# EAGLE design pov-globe2 (EAGLE 6.6.0)
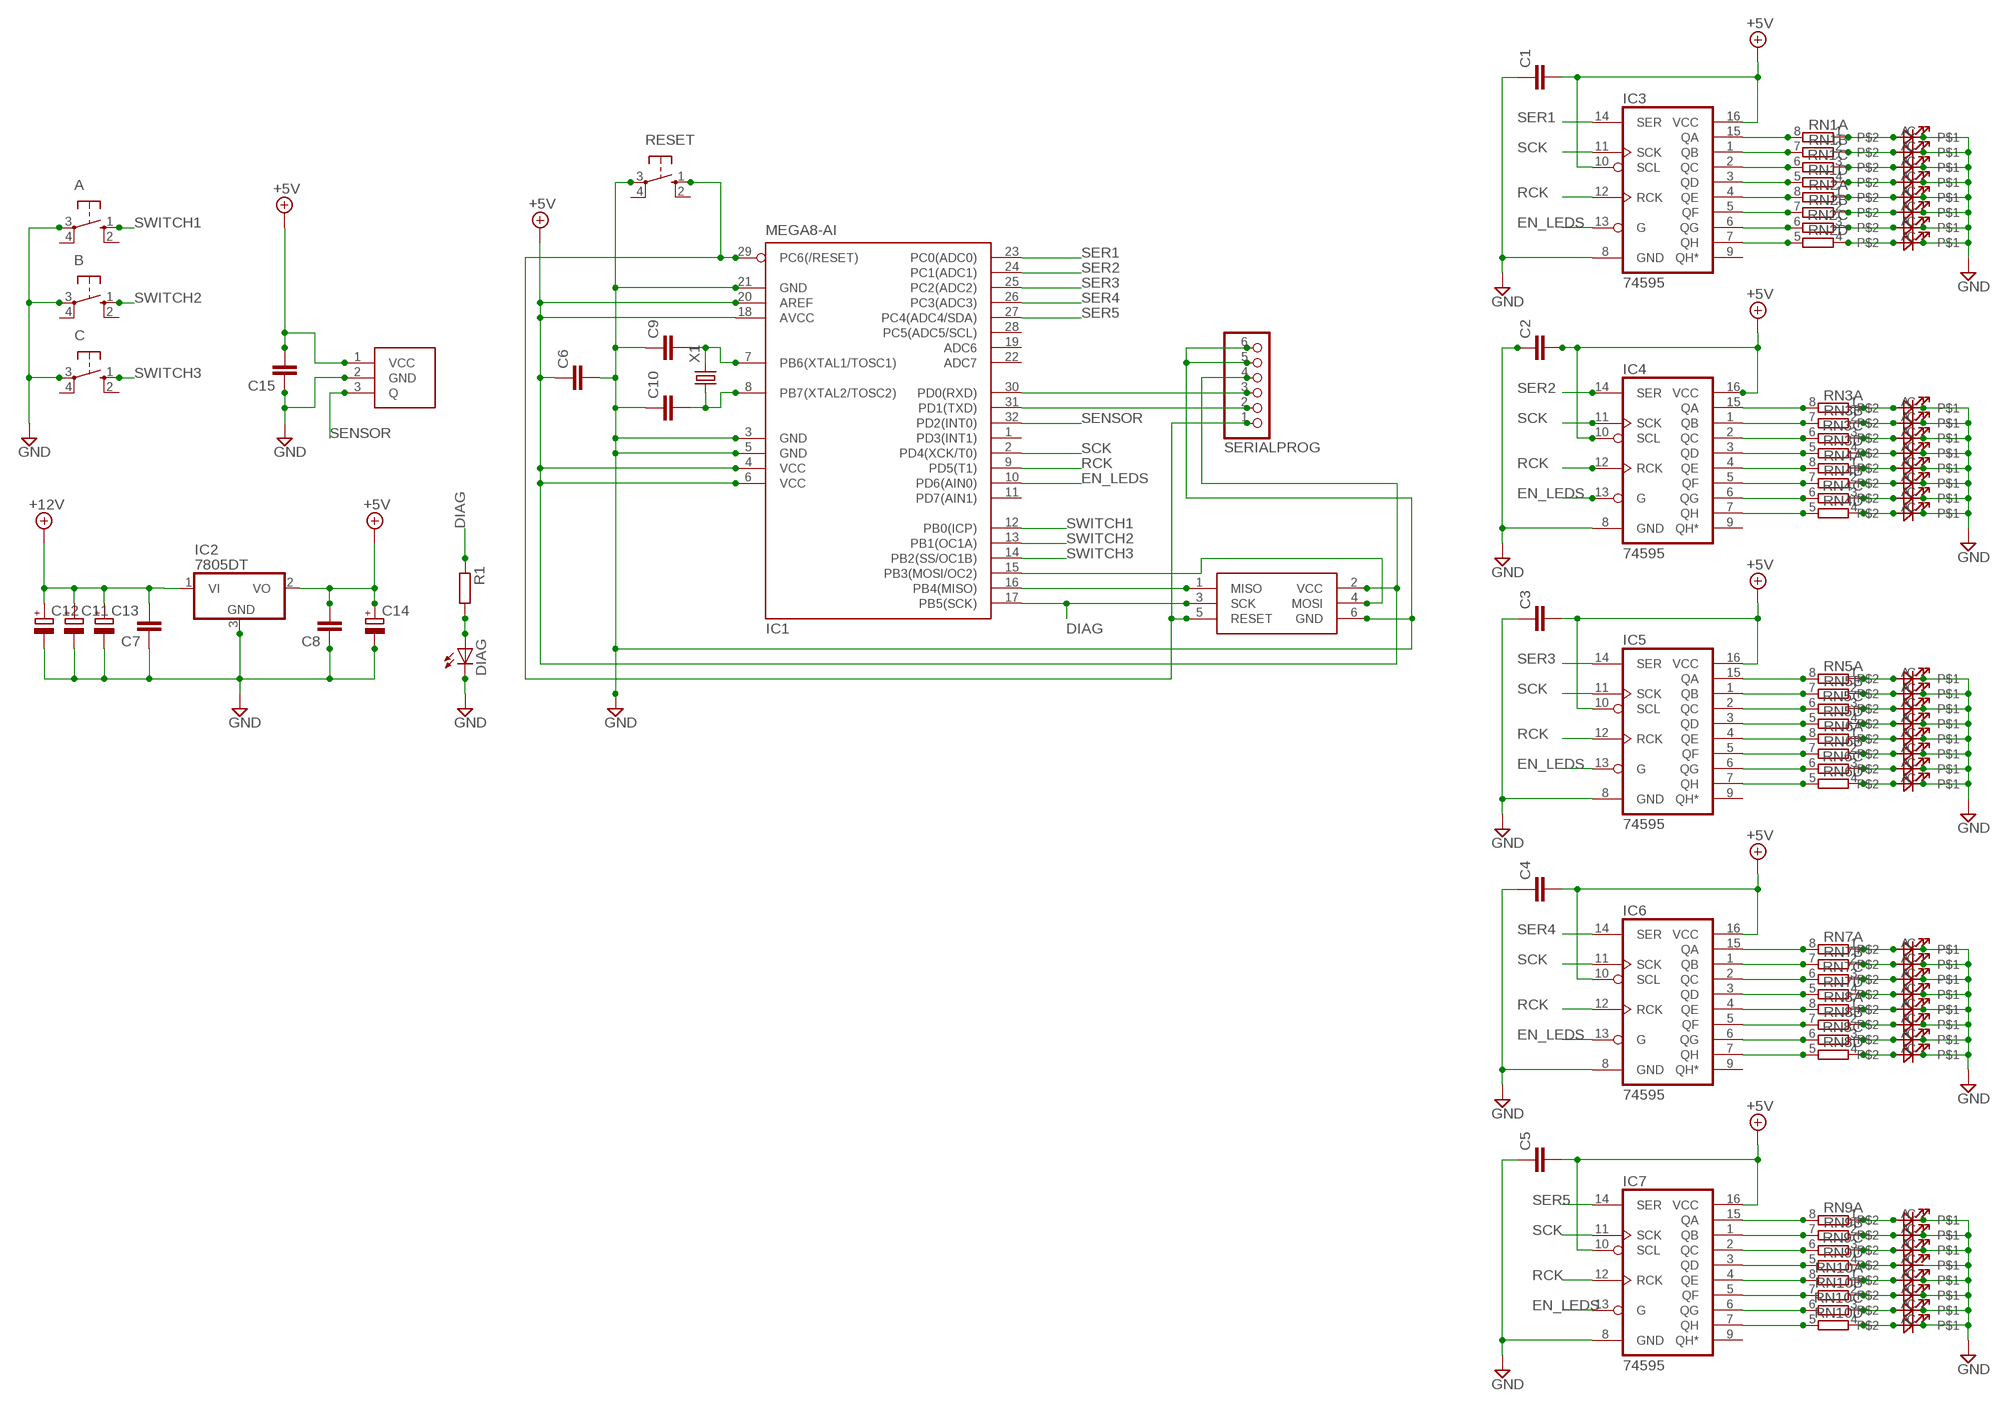
[diagram p0: schematic, sheet 1]

## Parts
0  3MMLEDSIDELED1_8MMSIDE  [LED1_8MMSIDE]
1  3MMLEDSIDELED1_8MMSIDE  [LED1_8MMSIDE]
2  3MMLEDSIDELED1_8MMSIDE  [LED1_8MMSIDE]
3  3MMLEDSIDELED1_8MMSIDE  [LED1_8MMSIDE]
4  3MMLEDSIDELED1_8MMSIDE  [LED1_8MMSIDE]
5  3MMLEDSIDELED1_8MMSIDE  [LED1_8MMSIDE]
6  3MMLEDSIDELED1_8MMSIDE  [LED1_8MMSIDE]
7  3MMLEDSIDELED1_8MMSIDE  [LED1_8MMSIDE]
8  3MMLEDSIDELED1_8MMSIDE  [LED1_8MMSIDE]
9  3MMLEDSIDELED1_8MMSIDE  [LED1_8MMSIDE]
10  3MMLEDSIDELED1_8MMSIDE  [LED1_8MMSIDE]
11  3MMLEDSIDELED1_8MMSIDE  [LED1_8MMSIDE]
12  3MMLEDSIDELED1_8MMSIDE  [LED1_8MMSIDE]
13  3MMLEDSIDELED1_8MMSIDE  [LED1_8MMSIDE]
14  3MMLEDSIDELED1_8MMSIDE  [LED1_8MMSIDE]
15  3MMLEDSIDELED1_8MMSIDE  [LED1_8MMSIDE]
16  3MMLEDSIDELED1_8MMSIDE  [LED1_8MMSIDE]
17  3MMLEDSIDELED1_8MMSIDE  [LED1_8MMSIDE]
18  3MMLEDSIDELED1_8MMSIDE  [LED1_8MMSIDE]
19  3MMLEDSIDELED1_8MMSIDE  [LED1_8MMSIDE]
20  3MMLEDSIDELED1_8MMSIDE  [LED1_8MMSIDE]
21  3MMLEDSIDELED1_8MMSIDE  [LED1_8MMSIDE]
22  3MMLEDSIDELED1_8MMSIDE  [LED1_8MMSIDE]
23  3MMLEDSIDELED1_8MMSIDE  [LED1_8MMSIDE]
24  3MMLEDSIDELED1_8MMSIDE  [LED1_8MMSIDE]
25  3MMLEDSIDELED1_8MMSIDE  [LED1_8MMSIDE]
26  3MMLEDSIDELED1_8MMSIDE  [LED1_8MMSIDE]
27  3MMLEDSIDELED1_8MMSIDE  [LED1_8MMSIDE]
28  3MMLEDSIDELED1_8MMSIDE  [LED1_8MMSIDE]
29  3MMLEDSIDELED1_8MMSIDE  [LED1_8MMSIDE]
30  3MMLEDSIDELED1_8MMSIDE  [LED1_8MMSIDE]
31  3MMLEDSIDELED1_8MMSIDE  [LED1_8MMSIDE]
32  3MMLEDSIDELED1_8MMSIDE  [LED1_8MMSIDE]
33  3MMLEDSIDELED1_8MMSIDE  [LED1_8MMSIDE]
34  3MMLEDSIDELED1_8MMSIDE  [LED1_8MMSIDE]
35  3MMLEDSIDELED1_8MMSIDE  [LED1_8MMSIDE]
36  3MMLEDSIDELED1_8MMSIDE  [LED1_8MMSIDE]
37  3MMLEDSIDELED1_8MMSIDE  [LED1_8MMSIDE]
38  3MMLEDSIDELED1_8MMSIDE  [LED1_8MMSIDE]
39  3MMLEDSIDELED1_8MMSIDE  [LED1_8MMSIDE]
A  10-XX  [B3F-10XX]
B  10-XX  [B3F-10XX]
C  10-XX  [B3F-10XX]
C1  C-EUC0805  [C0805]
C2  C-EUC0805  [C0805]
C3  C-EUC0805  [C0805]
C4  C-EUC0805  [C0805]
C5  C-EUC0805  [C0805]
C6  C-EUC0805  [C0805]
C7  C-EUC0805  [C0805]
C8  C-EUC0805  [C0805]
C9  C-EUC0805  [C0805]
C10  C-EUC0805  [C0805]
C11  CPOL-EUE2-5  [E2-5]
C12  CPOL-EUE2-5  [E2-5]
C13  CPOL-EUE2-5  [E2-5]
C14  CPOL-EUE2-5  [E2-5]
C15  C-EUC0805  [C0805]
DIAG  LEDCHIP-LED0805  [CHIP-LED0805]
IC1  MEGA8-AI  [TQFP32-08]
IC2  7805DT  [TO252]
IC3  74595  [TSSOP16]
IC4  74595  [TSSOP16]
IC5  74595  [TSSOP16]
IC6  74595  [TSSOP16]
IC7  74595  [TSSOP16]
ICSP  TAG_CONN_AVR  [TC2030-MCP-NL]
R1  R-EU_R0805  [R0805]
RESET  10-XX  [B3F-10XX]
RN1  4R-N0603-ARC  [0603-ARC]
RN2  4R-N0603-ARC  [0603-ARC]
RN3  4R-N0603-ARC  [0603-ARC]
RN4  4R-N0603-ARC  [0603-ARC]
RN5  4R-N0603-ARC  [0603-ARC]
RN6  4R-N0603-ARC  [0603-ARC]
RN7  4R-N0603-ARC  [0603-ARC]
RN8  4R-N0603-ARC  [0603-ARC]
RN9  4R-N0603-ARC  [0603-ARC]
RN10  4R-N0603-ARC  [0603-ARC]
S1  3144HALLSWITCH  [3144HALLSWITCH]
SERIALPROG  PINHD-1X6  [1X06]
X1  CRYSTALHC49U-V  [HC49U-V]

## Nets
+5V: C1.2 C2.2 C3.2 C4.2 C5.2 C6.1 C8.2 C14.+ C15.2 IC1.4(VCC) IC1.6(VCC) IC1.18(AVCC) IC1.20(AREF) IC2.2(VO) IC3.10(SCL) IC3.16(VCC) IC4.10(SCL) IC4.16(VCC) IC5.10(SCL) IC5.16(VCC) IC6.10(SCL) IC6.16(VCC) IC7.10(SCL) IC7.16(VCC) ICSP.2(VCC) S1.1(VCC) SERIALPROG.4
+12V: C7.2 C11.+ C12.+ C13.+ IC2.1(VI)
DIAG: IC1.17(PB5(SCK)) ICSP.3(SCK) R1.1
EN_LEDS: IC1.10(PD6(AIN0)) IC3.13(G) IC4.13(G) IC5.13(G) IC6.13(G) IC7.13(G)
GND: 0.C 1.C 2.C 3.C 4.C 5.C 6.C 7.C 8.C 9.C 10.C 11.C 12.C 13.C 14.C 15.C 16.C 17.C 18.C 19.C 20.C 21.C 22.C 23.C 24.C 25.C 26.C 27.C 28.C 29.C 30.C 31.C 32.C 33.C 34.C 35.C 36.C 37.C 38.C 39.C A.3(P) B.3(P) C1.1 C2.1 C3.1 C4.1 C5.1 C6.2 C7.1 C8.1 C9.1 C10.1 C11.- C12.- C13.- C14.- C15.1 C.3(P) DIAG.C IC1.3(GND) IC1.5(GND) IC1.21(GND) IC2.3(GND) IC3.8(GND) IC4.8(GND) IC5.8(GND) IC6.8(GND) IC7.8(GND) ICSP.6(GND) RESET.3(P) S1.2(GND) SERIALPROG.5 SERIALPROG.6
N$1: IC3.15(QA) RN1.8
N$2: IC3.1(QB) RN1.7
N$3: IC3.2(QC) RN1.6
N$4: IC3.3(QD) RN1.5
N$5: IC3.4(QE) RN2.8
N$6: IC3.5(QF) RN2.7
N$7: IC3.6(QG) RN2.6
N$8: IC3.7(QH) RN2.5
N$9: 0.A RN1.1
N$10: 1.A RN1.2
N$11: 2.A RN1.3
N$12: 3.A RN1.4
N$13: 4.A RN2.1
N$14: 5.A RN2.2
N$15: 6.A RN2.3
N$16: 7.A RN2.4
N$17: IC1.31(PD1(TXD)) SERIALPROG.2
N$18: IC1.30(PD0(RXD)) SERIALPROG.3
N$19: IC1.16(PB4(MISO)) ICSP.1(MISO)
N$20: IC6.15(QA) RN7.8
N$21: IC1.15(PB3(MOSI/OC2)) ICSP.4(MOSI)
N$22: IC6.1(QB) RN7.7
N$23: IC4.15(QA) RN3.8
N$24: IC4.1(QB) RN3.7
N$25: IC4.2(QC) RN3.6
N$26: IC4.3(QD) RN3.5
N$27: IC4.4(QE) RN4.8
N$28: IC4.5(QF) RN4.7
N$29: IC4.6(QG) RN4.6
N$30: IC4.7(QH) RN4.5
N$31: 8.A RN3.1
N$32: 9.A RN3.2
N$33: 10.A RN3.3
N$34: 11.A RN3.4
N$35: 12.A RN4.1
N$36: 13.A RN4.2
N$37: 14.A RN4.3
N$38: IC1.29(PC6(/RESET)) ICSP.5(RESET) RESET.1(S) SERIALPROG.1
N$39: DIAG.A R1.2
N$40: 15.A RN4.4
N$41: IC5.15(QA) RN5.8
N$42: IC5.1(QB) RN5.7
N$43: IC5.2(QC) RN5.6
N$44: IC5.3(QD) RN5.5
N$45: IC5.4(QE) RN6.8
N$46: IC5.5(QF) RN6.7
N$47: IC5.6(QG) RN6.6
N$48: IC5.7(QH) RN6.5
N$49: 16.A RN5.1
N$50: 17.A RN5.2
N$51: 18.A RN5.3
N$52: 19.A RN5.4
N$53: 20.A RN6.1
N$54: 21.A RN6.2
N$55: 22.A RN6.3
N$56: 23.A RN6.4
N$57: IC6.2(QC) RN7.6
N$58: IC6.3(QD) RN7.5
N$59: C9.2 IC1.7(PB6(XTAL1/TOSC1)) X1.2
N$60: C10.2 IC1.8(PB7(XTAL2/TOSC2)) X1.1
N$61: IC6.4(QE) RN8.8
N$62: IC6.5(QF) RN8.7
N$63: IC6.6(QG) RN8.6
N$64: IC6.7(QH) RN8.5
N$65: IC7.15(QA) RN9.8
N$66: 24.A RN7.1
N$67: 25.A RN7.2
N$68: 26.A RN7.3
N$69: 27.A RN7.4
N$70: 28.A RN8.1
N$71: 29.A RN8.2
N$72: 30.A RN8.3
N$73: 31.A RN8.4
N$74: IC7.1(QB) RN9.7
N$75: IC7.2(QC) RN9.6
N$76: IC7.3(QD) RN9.5
N$77: IC7.4(QE) RN10.8
N$78: IC7.5(QF) RN10.7
N$79: IC7.6(QG) RN10.6
N$80: IC7.7(QH) RN10.5
N$81: 32.A RN9.1
N$82: 33.A RN9.2
N$83: 34.A RN9.3
N$84: 35.A RN9.4
N$85: 36.A RN10.1
N$86: 37.A RN10.2
N$87: 38.A RN10.3
N$88: 39.A RN10.4
RCK: IC1.9(PD5(T1)) IC3.12(RCK) IC4.12(RCK) IC5.12(RCK) IC6.12(RCK) IC7.12(RCK)
SCK: IC1.2(PD4(XCK/T0)) IC3.11(SCK) IC4.11(SCK) IC5.11(SCK) IC6.11(SCK) IC7.11(SCK)
SENSOR: IC1.32(PD2(INT0)) S1.3(Q)
SER1: IC1.23(PC0(ADC0)) IC3.14(SER)
SER2: IC1.24(PC1(ADC1)) IC4.14(SER)
SER3: IC1.25(PC2(ADC2)) IC5.14(SER)
SER4: IC1.26(PC3(ADC3)) IC6.14(SER)
SER5: IC1.27(PC4(ADC4/SDA)) IC7.14(SER)
SWITCH1: A.1(S) IC1.12(PB0(ICP))
SWITCH2: B.1(S) IC1.13(PB1(OC1A))
SWITCH3: C.1(S) IC1.14(PB2(SS/OC1B))
Unconnected: A.2(S1) A.4(P1) B.2(S1) B.4(P1) C.2(S1) C.4(P1) IC1.1(PD3(INT1)) IC1.11(PD7(AIN1)) IC1.19(ADC6) IC1.22(ADC7) IC1.28(PC5(ADC5/SCL)) IC3.9(QH*) IC4.9(QH*) IC5.9(QH*) IC6.9(QH*) IC7.9(QH*) RESET.2(S1) RESET.4(P1)

## Library data of the parts
0 1-39 = jason_eagle6:3MMLEDSIDE
A B C RESET = switch-omron:10-XX: OMRON SWITCH
C1-C10 C15 = rcl:C-EU: CAPACITOR, European symbol
C11-C14 = rcl:CPOL-EU: POLARIZED CAPACITOR, European symbol
DIAG = led:LED: LED OSRAM: - CHIPLED LG R971, LG N971, LY N971, LG Q971, LY Q971, LO R971, LY R971 LH N974, LH R974 LS Q976, LO Q976, LY Q976 LO Q996 - Hyper CHIPLED LW Q18S LB Q993, LB Q99A, LB R99A - SideLED LS A670, LO A670, LY A670, LG A670, LP A670 LB A673, LV A673, LT A673, LW A673 LH A674 LY A675 LS A676, LA A676, LO A676, LY A676, LW A676 LS A679, LY A679, LG A679 - Hyper Micro SIDELED® LS Y876, LA Y876, LO Y876, LY Y876 LT Y87S - SmartLED LW L88C, LW L88S LB L89C, LB L89S, LG L890 LS L89K, LO L89K, LY L89K LS L896, LA L896, LO L896, LY L896 - TOPLED LS T670, LO T670, LY T670, LG T670, LP T670 LSG T670, LSP T670, LSY T670, LOP T670, LYG T670 LG T671, LOG T671, LSG T671 LB T673, LV T673, LT T673, LW T673 LH T674 LS T676, LA T676, LO T676, LY T676, LB T676, LH T676, LSB T676, LW T676 LB T67C, LV T67C, LT T67C, LS T67K, LO T67K, LY T67K, LW E67C LS E67B, LA E67B, LO E67B, LY E67B, LB E67C, LV E67C, LT E67C LW T67C LS T679, LY T679, LG T679 LS T770, LO T770, LY T770, LG T770, LP T770 LB T773, LV T773, LT T773, LW T773 LH T774 LS E675, LA E675, LY E675, LS T675 LS T776, LA T776, LO T776, LY T776, LB T776 LHGB T686 LT T68C, LB T68C - Hyper Mini TOPLED® LB M676 - Mini TOPLED Santana® LG M470 LS M47K, LO M47K, LY M47K Source: http://www.osram.convergy.de LUXEON: - LUMILED® LXK2-PW12-R00, LXK2-PW12-S00, LXK2-PW14-U00, LXK2-PW14-V00 LXK2-PM12-R00, LXK2-PM12-S00, LXK2-PM14-U00 LXK2-PE12-Q00, LXK2-PE12-R00, LXK2-PE12-S00, LXK2-PE14-T00, LXK2-PE14-U00 LXK2-PB12-K00, LXK2-PB12-L00, LXK2-PB12-M00, LXK2-PB14-N00, LXK2-PB14-P00, LXK2-PB14-Q00 LXK2-PR12-L00, LXK2-PR12-M00, LXK2-PR14-Q00, LXK2-PR14-R00 LXK2-PD12-Q00, LXK2-PD12-R00, LXK2-PD12-S00 LXK2-PH12-R00, LXK2-PH12-S00 LXK2-PL12-P00, LXK2-PL12-Q00, LXK2-PL12-R00 Source: www.luxeon.com KINGBRIGHT: KA-3528ASYC Source: www.kingbright.com
IC1 = atmel:MEGA8: MICROCONTROLLER 8 Kbytes FLASH, 1 kbytes SRAM, 512 bytes EEPROM, USART, 6-channel 10 bit ADC, 2-channel 8 bit ADC Pin compatible with Atmega48, ATMega88, ATMega168 Source: avr.lbr
IC2 = linear:78*: Positive VOLTAGE REGULATOR Source: http://cache.national.com/ds/LM/LM78L05.pdf http://www.fairchildsemi.com/ds/LM/LM7805.pdf
IC3-IC7 = SparkFun:74*595: 8-bit SHIFT REGISTER, output latch
ICSP = jasons_stuff:TAG_CONN_AVR
R1 = resistor:R-EU_: RESISTOR, European symbol
RN1-RN10 = resistor-dil:4R-N: Array Chip Resistor Source: RS Component / Phycomp; OC_FARNELL: unknown; OC_NEWARK: unknown
S1 = jason_eagle6:3144HALLSWITCH
SERIALPROG = pinhead:PINHD-1X6: PIN HEADER
X1 = crystal:CRYSTAL: CRYSTAL

## Board
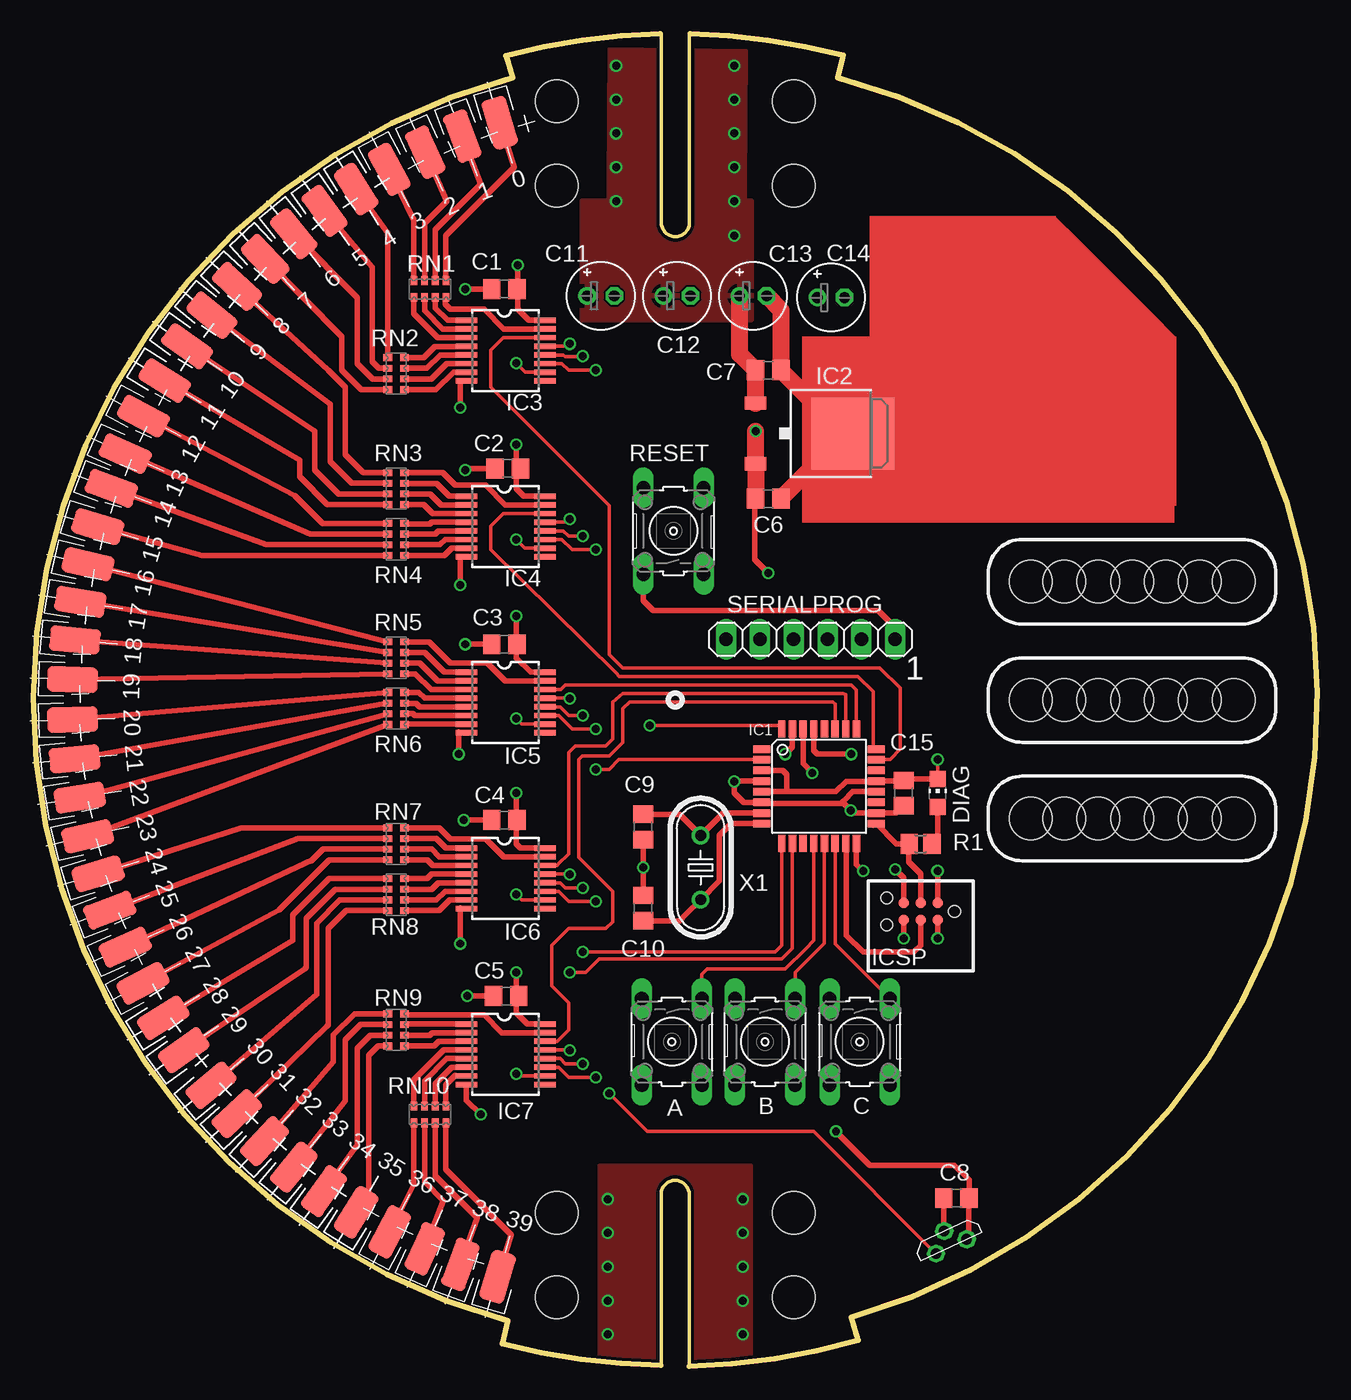
[diagram p1: board, top side]
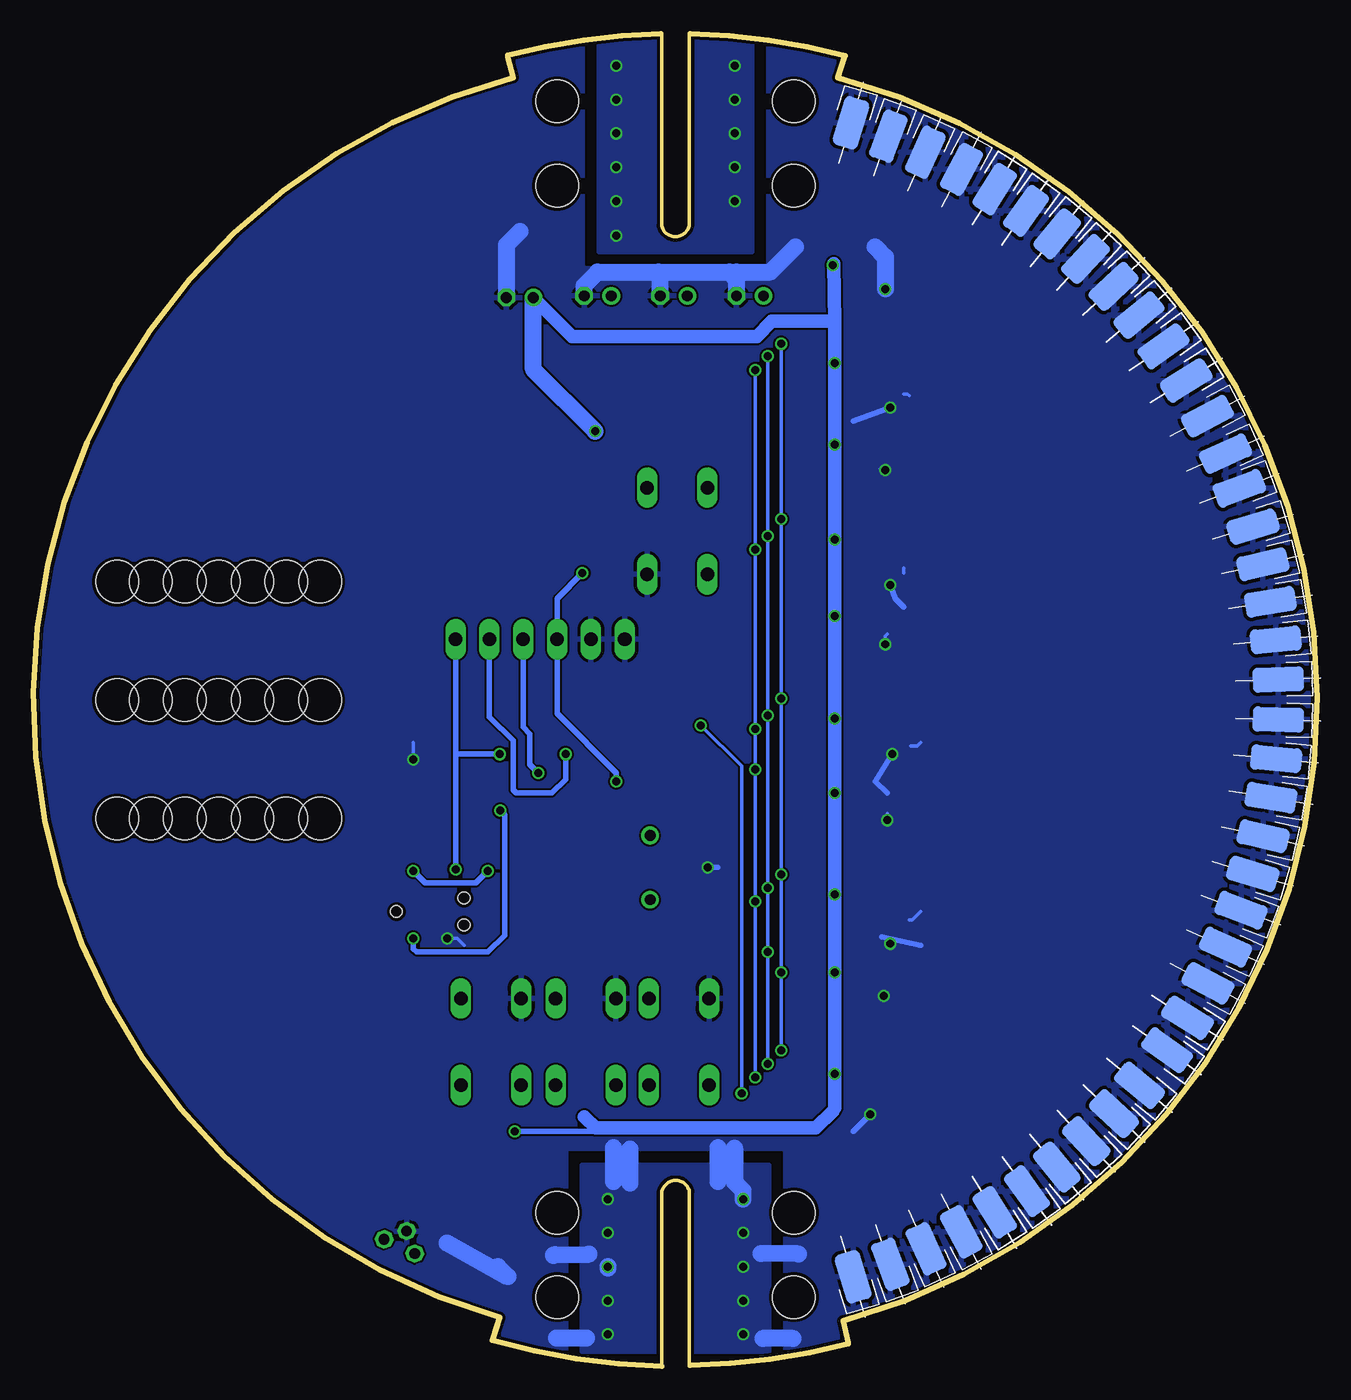
[diagram p2: board, bottom side, seen from below]

Size 96.38 x 100.08 mm. Coordinates in mm from the lower left corner, seen from the top.
Outline: 35.48,98.4 35.99,96.75 arc150 35.61,3.4 35.23,1.75
Outline: 61.9,2.01 61.39,3.66 arc149 60.37,96.75 60.75,98.27
Outline: 47.14,100.08 47.14,85.67
Outline: 49.22,100.03 49.22,85.65
Outline: 49.22,13.08 49.22,0 arc15 61.92,1.93
Outline: 47.14,0 47.14,13.11
Outline: 49.2,13.13 arc154 47.14,13.13
Outline: 47.16,85.62 arc154 49.22,85.62
Outline: 35.46,98.4 arc-13 47.06,100.05
Outline: 49.3,100.05 arc-13 60.78,98.42
Outline: 35.2,1.7 arc14 47.09,0.08
Copper layers (1*16): Top 0.035mm / dielectric 1.5mm / Bottom 0.035mm
Design rules "ITEADstudio_DRC": minimum track width 6mil, minimum drill 12mil, track to track 6mil, track to pad 6mil, pad to pad 6mil, via to via 6mil, smd to smd 0mil, copper to edge 10mil, drill to drill 10mil, minimum pad ring 10mil, minimum via ring 6mil, stop-mask expansion 2mil, vias tented up to drill 100mil, thermal gap 10mil
Holes 3.2 mm at 79.93,58.9 90.09,58.9 82.47,58.9 74.85,58.9 77.39,58.9 85.01,58.9 87.55,58.9 79.93,50.01 90.09,50.01 82.47,50.01 74.85,50.01 77.39,50.01 85.01,50.01 87.55,50.01 79.93,41.12 90.09,41.12 82.47,41.12 74.85,41.12 77.39,41.12 85.01,41.12 87.55,41.12 39.29,88.62 57.07,88.62 39.29,11.53 57.07,11.53 39.29,94.97 57.07,94.97 39.29,5.18 57.07,5.18

### Footprints (pad centres in the part's own frame; a part is rotated, then mirrored left to right if it is on the bottom)
LED1_8MMSIDE = smd 3.81 x 1.905: A -3.175,0 | smd 3.81 x 1.905 bottom: C -3.175,0
B3F-10XX = drill 1.016 long: 1 -3.251,2.261; 2 3.251,2.261; 3 -3.251,-2.261; 4 3.251,-2.261
C0805 = smd 1.3 x 1.5: 1 -0.95,0; 2 0.95,0
E2-5 = drill 0.813 pad 1.27: + -1.016,0 | drill 0.813 pad 1.27 octagon: - 1.016,0
CHIP-LED0805 = smd 1.2 x 1.2: A 0,-1.05; C 0,1.05
TQFP32-08 = smd 1.27 x 0.559: 1 -4.293,2.8; 2 -4.293,2; 3 -4.293,1.2; 4 -4.293,0.4; 5 -4.293,-0.4; 6 -4.293,-1.2; 7 -4.293,-2; 8 -4.293,-2.8; 17 4.293,-2.8; 18 4.293,-2; 19 4.293,-1.2; 20 4.293,-0.4; 21 4.293,0.4; 22 4.293,1.2; 23 4.293,2; 24 4.293,2.8 | smd 0.559 x 1.27: 9 -2.8,-4.293; 10 -2,-4.293; 11 -1.2,-4.293; 12 -0.4,-4.293; 13 0.4,-4.293; 14 1.2,-4.293; 15 2,-4.293; 16 2.8,-4.293; 25 2.8,4.293; 26 2,4.293; 27 1.2,4.293; 28 0.4,4.293; 29 -0.4,4.293; 30 -1.2,4.293; 31 -2,4.293; 32 -2.8,4.293
TO252 = smd 1 x 1.6: 1 -2.28,-4.8; 2 2.28,-4.8 | smd 5.4 x 6.2: 3 0,2.5
TSSOP16 = smd 0.4 x 1.6: 1 -2.225,-2.85; 2 -1.575,-2.85; 3 -0.925,-2.85; 4 -0.275,-2.85; 5 0.375,-2.85; 6 1.025,-2.85; 7 1.675,-2.85; 8 2.325,-2.85; 9 2.325,3.05; 10 1.675,3.05; 11 1.025,3.05; 12 0.375,3.05; 13 -0.275,3.05; 14 -0.925,3.05; 15 -1.575,3.05; 16 -2.225,3.05
TC2030-MCP-NL = smd 0.787 x 0.787: 1 1.27,-0.635; 2 1.27,0.635; 3 2.54,-0.635; 4 2.54,0.635; 5 3.81,-0.635; 6 3.81,0.635 | hole 0.889: 0,0; 5.08,-1.016; 5.08,1.016
R0805 = smd 1.3 x 1.5: 1 -0.85,0; 2 0.85,0
0603-ARC = smd 0.5 x 0.65: 1 -1.2,-0.625; 2 -0.4,-0.625; 3 0.4,-0.625; 4 1.2,-0.625; 5 1.2,0.625; 6 0.4,0.625; 7 -0.4,0.625; 8 -1.2,0.625
3144HALLSWITCH = drill 0.8 octagon: 1 -1.905,-1.27; 2 -0.635,0; 3 -1.905,1.27
1X06 = drill 1.016 long: 1 -6.35,0; 2 -3.81,0; 3 -1.27,0; 4 1.27,0; 5 3.81,0; 6 6.35,0
HC49U-V = drill 0.813: 1 -2.413,0; 2 2.413,0

### Placement (x,y rotation side)
0  34.08,96.39 106.9 top
1  31.09,95.33 110.6 top
2  28.11,94.03 114.4 top
3  25.22,92.66 118.1 top
4  22.55,91.08 121.9 top
5  20.01,89.33 125.6 top
6  17.52,87.48 129.4 top
7  15.24,85.45 133.1 top
8  12.98,83.24 136.9 top
9  10.94,80.92 140.6 top
10  8.96,78.44 144.4 top
11  7.16,75.69 148.1 top
12  5.46,72.82 151.9 top
13  4.01,69.82 155.6 top
14  2.89,67.03 159.4 top
15  1.8,63.96 163.1 top
16  1.01,60.93 166.9 top
17  0.4,57.91 170.6 top
18  -0.03,54.84 174.4 top
19  -0.23,51.66 178.1 top
20  -0.23,48.44 181.9 top
21  -0.05,45.29 185.6 top
22  0.35,42.16 189.4 top
23  0.99,39.07 193.1 top
24  1.83,36.04 196.9 top
25  2.76,33.12 200.6 top
26  4.01,30.15 204.4 top
27  5.43,27.25 208.1 top
28  7.06,24.49 211.9 top
29  8.71,21.87 215.6 top
30  10.89,19.08 219.4 top
31  12.95,16.79 223.1 top
32  15.19,14.58 226.9 top
33  17.55,12.5 230.6 top
34  19.96,10.57 234.4 top
35  22.55,8.86 238.1 top
36  25.24,7.29 241.9 top
37  28.06,5.92 245.6 top
38  30.93,4.67 249.4 top
39  33.93,3.68 253.1 top
A  47.93,24.36 270 top
B  54.91,24.36 270 top
C  62.02,24.36 270 top
C1  35.35,80.87 0 top
C2  35.61,67.41 0 top
C3  35.35,54.2 0 top
C4  35.35,41 0 top
C5  35.48,27.79 0 top
C6  55.17,65.13 0 top
C7  55.17,74.78 180 top
C8  69.29,12.62 0 top
C9  45.77,40.49 90 top
C10  45.77,34.39 270 top
C11  42.59,80.37 0 top
C12  48.31,80.37 0 top
C13  54.02,80.37 0 top
C14  59.86,80.24 0 top
C15  65.33,43.03 270 top
DIAG  67.87,43.03 0 top
IC1  58.98,43.54 0 top
IC2  59,70.03 270 top
IC3  35.35,76.3 270 top
IC4  35.35,63.09 270 top
IC5  35.35,49.89 270 top
IC6  35.35,36.68 270 top
IC7  35.35,23.47 270 top
ICSP  69.14,34.14 180 top
R1  66.6,39.22 0 top
RESET  48.05,62.71 90 top
RN1  29.77,80.87 180 top
RN2  27.23,74.52 270 top
RN3  27.23,65.89 270 top
RN4  27.23,62.08 270 top
RN5  27.23,53.19 270 top
RN6  27.23,49.38 270 top
RN7  27.23,39.22 270 top
RN8  27.23,35.41 270 top
RN9  27.23,25.25 270 top
RN10  29.77,18.9 0 top
S1  68.09,10.72 115 top
SERIALPROG  58.34,54.58 180 top
X1  50.09,37.44 90 top

### Tracks (layer width: path | path; a pad name or v marks a point on that pad's centre or on a via)
+5V  (via drill 0.6)
  Top 0.254: 36.37,27.73 C5.2 | 36.24,40.93 C4.2 | 36.5,67.35 C2.2 | IC7.10 36.39,21.79 v36.24,21.95 | IC6.10 36.65,35 v36.24,35.41 | IC5.10 36.67,48.21 v36.24,48.64 | IC4.10 36.9,61.42 v36.24,62.08 | IC3.10 36.93,74.63 v36.24,75.31 | 54.61,42.27 IC1.6 54.75,42.27
  Top 0.406: C15.2 64.78,41.54 IC1.18 61.52,41.54 v61.34,41.71 60.82,42.23 60.82,42.46 | IC1.20 61.5,43.14 60.82,42.46 | 54.75,42.27 60.63,42.27 60.82,42.46 | IC1.6 53.32,42.34 52.63,43.03 v52.63,43.92 52.64,43.94 IC1.4 54.66,43.92 | v60.25,17.63 62.79,15.09 69.14,15.09 70.24,13.99 C8.2 70.2,12.59 70.2,9.68 S1.1 | IC2.2 54.22,67.76 | C6.1 54.15,65.06 54.15,60.55 v55.17,59.54 | ICSP.2 v67.87,32.11 | v36.24,29.57 36.24,27.98 C5.2 36.12,27.79 36.24,27.66 36.24,26.52 37.07,25.69 IC7.16 | IC6.16 36.56,38.9 36.24,39.22 36.24,40.93 | v36.24,43.03 36.24,41.06 C4.2 | IC5.16 37.32,52.11 36.24,53.19 36.24,54.14 C3.2 36.24,54.26 v36.24,56.34 | IC4.16 36.81,65.32 36.24,65.89 36.24,67.1 C2.2 36.24,67.73 v36.24,69.19 | 36.25,80.82 C1.2 | IC3.16 37.19,78.53 36.37,79.35 36.37,80.81 C1.2 | v36.37,82.65 36.37,80.94 C1.2
  Top 1.27: IC2.2 54.22,67.73 C6.1 | 54.22,67.76 v54.22,70.21
  Bottom 0.406: 55.04,18.72 53.95,17.63 | 53.95,17.63 53.9,17.63 | 53.95,17.63 v60.25,17.63 | SERIALPROG.4 57.07,56.74 | v55.17,59.54 57.07,57.63 SERIALPROG.4 | v67.87,32.11 67.87,31.34 67.61,31.09 62.28,31.09 61.01,32.36 61.01,41.38 v61.34,41.71 | SERIALPROG.4 57.07,49 52.63,44.55 v52.63,43.92 | 36.37,78.46 v36.37,82.65
  Bottom 1.016: 36.29,82.78 36.24,78.33 | 36.24,78.33 v36.24,75.31 v36.24,69.19 v36.24,62.08 v36.24,56.34 v36.24,48.64 v36.24,43.03 v36.24,35.41 v36.24,29.57 v36.24,21.95 36.24,19.41 36.37,19.15 37.64,17.88 54.15,17.88 55.04,18.72 | C14.+ 55.93,77.32 42.08,77.32 40.94,78.46 36.37,78.46 36.24,78.33
  Bottom 1.27: v54.22,70.21 58.85,74.84 C14.+
+12V  (via drill 0.6)
  Top 1.27: IC2.1 54.2,74.76 C7.2 53.01,75.99 C13.+
  other vias: 43.74,97.64 43.74,95.1 43.74,92.56 43.74,90.02 43.74,87.48 52.63,97.64 52.63,95.1 52.63,92.56 52.63,90.02 52.63,87.48 52.63,84.89
  pour Top: 43.23,98.91 43.1,83.54 53.39,83.41 53.51,98.78
  pour Bottom: 42.47,83.67 42.47,101.45 53.9,101.45 53.9,83.67
  pour Top: 47.55,78.59 53.9,78.59 53.9,87.48 41.2,87.48 41.2,78.59
DIAG
  Top 0.254: 63.04,40.51 IC1.17
  Top 0.406: IC1.17 64.79,39.22 R1.1 65.71,39.18 65.71,37.85 66.6,36.96 ICSP.3
EN_LEDS  (via drill 0.6)
  Top 0.254: IC5.13 39.98,50.16 v40.26,50.14 | IC6.13 40.23,36.95 v40.26,36.93 | IC7.13 40.02,23.74 v40.26,23.72 | IC4.13 40.02,63.37 v40.26,63.6 | IC3.13 40.07,76.58 v40.26,76.76 | IC1.10 56.98,31.38 56.18,30.58 42.47,30.58 41.45,29.57 v40.26,29.57
  Bottom 0.254: v40.26,76.76 40.26,64.62 | 40.26,64.62 v40.26,63.6 | v40.26,63.6 40.26,50.65 | 40.26,50.65 v40.26,50.14 | v40.26,50.14 40.26,37.95 | 40.26,37.95 v40.26,36.93 | v40.26,36.93 v40.26,29.57 | v40.26,29.57 40.26,27.79 | 40.26,27.79 40.26,25.25 | 40.26,25.25 v40.26,23.72 40.26,25.25 | v40.26,50.14 40.26,50.65 | v40.26,63.6 40.26,64.62 | v40.26,36.93 40.26,37.95 | v40.26,29.57 40.26,27.79
GND  (via drill 0.6)
  Top 0.254: IC3.8 32.01,73.98 | 63.16,44.04 IC1.21 | DIAG.C v67.87,45.57 | S1.2 68.34,10.17
  Top 0.406: IC1.21 63.8,43.94 | 63.8,43.94 65.28,43.94 C15.1 65.43,44.08 DIAG.C | C10.1 v45.77,37.44 C9.1 | IC1.5 56.56,43.14 | 56.56,43.14 60.23,43.14 61.01,43.92 63.78,43.92 63.8,43.94 | IC1.3 56.25,44.74 56.56,44.42 56.56,43.14 | 68.34,10.17 C8.1 | ICSP.6 v65.33,32.11 | IC7.8 32.5,19.97 v33.58,18.9 | IC4.8 32.09,60.77 32.05,60.81 v32.05,58.65 | IC5.8 31.96,47.56 31.92,47.6 v31.92,45.95 | v32.05,71.98 32.05,73.94 32.01,73.98 | IC6.8 32.09,34.35 32.05,34.39 v32.05,31.72 | C2.1 32.56,67.41 v32.43,67.28 | C3.1 v32.43,54.2 | C4.1 v32.31,41 | C5.1 v32.56,27.79 | C1.1 v32.43,80.87
  Top 1.27: C13.- 56.12,79.29 C7.1 60.69,70.21 60.69,69.7 | C6.2 60.69,69.7 | 60.69,69.7 61.52,69.7 61.5,69.71 IC2.3
  Bottom 0.254: 31.04,73 30.78,73 30.65,72.87 | v32.43,67.28 32.81,67.41 32.56,67.16 | 31.04,59.92 31.04,59.54 | v32.43,54.2 32.43,54.84 32.31,54.97 | 30.53,46.58 30.02,46.58 29.77,46.84 | v32.31,41 32.31,41.5 | 30.65,33.5 30.4,33.5 29.77,34.14 | v32.56,27.79 32.31,27.79 | v67.87,45.57 67.87,46.84 | v65.33,32.11 64.56,32.11 64.06,31.6
  Bottom 0.406: v45.77,37.44 45.01,37.44 | 51.58,13.77 52.83,13.77 52.83,13.87 | v33.58,18.9 34.85,17.63 | v32.05,71.98 34.85,70.97 | v32.05,58.65 31.67,57.63 31.04,57 | v31.92,45.95 33.19,43.92 32.31,43.03 | 32.69,32.23 29.77,31.6
  Bottom 1.27: 59.86,85.19 60.88,84.18 C14.- | C13.- 55.04,81.13 54.02,82.14 49.45,82.14 | 49.45,82.14 44.12,82.14 43.61,81.64 | 43.61,81.64 C11.- | C12.- 49.32,82.02 49.45,82.14 | 43.61,81.64 43.61,82.14 41.07,82.14 39.16,84.05 | 33.19,84.05 32.43,83.29 v32.43,80.87 | 65.33,9.26 60.77,6.72 61.52,7.47 | v53.26,7.47 53.26,7.36 | 43.74,16.36 43.74,13.82 43.1,13.18 v43.1,12.55 | 51.58,13.77 51.58,16.31 | 57.32,8.31 57.32,8.33 | 45.01,16.41 45.01,13.87 | 52.83,13.87 52.83,16.41 | 38.96,8.43 41.75,8.46 | 39.37,2.08 41.63,2.08 | 54.86,2.11 57.12,2.11 | 57.22,8.38 54.66,8.41
  other vias: 43.1,2.39 43.1,4.93 43.1,7.47 43.1,10.01 53.26,2.39 53.26,4.93 53.26,10.01 53.26,12.55
  pour Top: 42.47,15.09 53.9,15.09 53.9,-1.42 42.47,-1.42
  pour Bottom: 41.2,100.18 41.2,82.4 55.17,82.4 55.17,100.18 100.89,100.18 100.89,-1.42 56.44,-1.42 56.44,16.36 39.93,16.36 39.93,-1.42 -7.06,-1.42 -7.06,100.18
  pour Bottom: 41.2,15.09 55.17,15.09 55.17,1.12 41.2,1.12
N$1
  Top 0.406: IC3.15 35.3,77.88 33.83,79.35 31.29,79.35 30.91,79.73 30.91,80.19 RN1.8
N$2
  Top 0.406: RN1.7 30.17,79.46 31.1,78.53 IC3.1
N$3
  Top 0.406: RN1.6 29.37,79.24 30.73,77.88 IC3.2
N$4
  Top 0.406: IC3.3 30.36,77.23 28.57,79.03 RN1.5
N$5
  Top 0.406: RN2.8 29.31,75.72 30.15,76.56 32.48,76.56 IC3.4
N$6
  Top 0.406: RN2.7 29.53,74.92 30.53,75.92 IC3.5
N$7
  Top 0.406: RN2.6 29.87,74.12 31.04,75.29 32.49,75.29 IC3.6
N$8
  Top 0.406: RN2.5 30.22,73.32 31.54,74.65 32.48,74.65 IC3.7
N$9
  Top 0.406: RN1.1 30.97,84.87 36.12,90.02 0.A
N$10
  Top 0.406: RN1.2 30.17,85.34 33.58,88.75 1.A
N$11
  Top 0.406: RN1.3 29.37,85.81 31.04,87.48 2.A
N$12
  Top 0.406: RN1.4 28.57,86.14 28.5,86.21 3.A
N$13
  Top 0.406: RN2.1 26.6,85.05 26.59,85.06 4.A
N$14
  Top 0.406: RN2.2 25.94,74.92 25.45,75.41 25.45,82.52 5.A
N$15
  Top 0.406: RN2.3 25.47,74.12 24.3,75.29 24.3,80.24 6.A
N$16
  Top 0.406: RN2.4 24.62,73.32 23.16,74.78 23.16,77.32 7.A
N$17  (via drill 0.6)
  Top 0.406: IC1.31 56.98,46.49 v56.44,45.95
  Bottom 0.406: SERIALPROG.2 62.15,48.74 60.37,46.96 60.37,43.28 60.12,43.03 57.45,43.03 56.44,44.04 v56.44,45.95
N$18  (via drill 0.6)
  Top 0.406: IC1.30 57.78,45.75 57.78,45.62 57.78,45.24 v58.47,44.55
  Bottom 0.406: SERIALPROG.3 59.61,53.57 59.61,47.98 59.1,47.47 59.1,45.19 v58.47,44.55
N$19  (via drill 0.6)
  Top 0.406: ICSP.1 v67.87,37.19 | IC1.16 61.78,37.69 v62.28,37.19
  Bottom 0.406: v62.28,37.19 63.17,36.3 66.98,36.3 v67.87,37.19
N$20
  Top 0.406: IC6.15 35.3,38.25 33.96,39.6 31.29,39.6 30.47,40.42 RN7.8
N$21
  Top 0.254: 61.01,39.21 IC1.15
  Top 0.406: 61.01,39.21 61.01,32.36 62.28,31.09 66.09,31.09 66.6,31.6 ICSP.4
N$22
  Top 0.406: IC6.1 30.97,38.9 30.25,39.62 RN7.7
N$23
  Top 0.406: RN3.8 30.72,67.09 31.67,66.14 33.96,66.14 35.43,64.67 IC4.15
N$24
  Top 0.406: IC4.1 31.22,65.32 30.27,66.27 27.87,66.27 RN3.7
N$25
  Top 0.406: RN3.6 29.78,65.49 30.6,64.67 IC4.2
N$26
  Top 0.406: IC4.3 29.98,64.02 29.31,64.69 RN3.5
N$27
  Top 0.406: IC4.4 29.91,63.37 29.77,63.22 27.91,63.22 RN4.8
N$28
  Top 0.406: RN4.7 30.17,62.48 30.4,62.71 IC4.5
N$29
  Top 0.406: RN4.6 30.51,61.68 30.91,62.08 32.49,62.08 IC4.6
N$30
  Top 0.406: RN4.5 30.85,60.88 31.39,61.42 IC4.7
N$31
  Top 0.406: RN3.1 24.76,67.09 23.42,68.43 23.42,73.51 22.15,74.78 8.A
N$32
  Top 0.406: RN3.2 23.9,66.29 22.27,67.92 22.27,72.24 9.A
N$33
  Top 0.406: RN3.3 22.93,65.49 21.13,67.28 21.13,70.21 10.A
N$34
  Top 0.406: RN3.4 22.08,64.69 19.99,66.78 19.99,68.05 11.A
N$35
  Top 0.406: RN4.1 21.71,63.28 19.61,65.38 12.A
N$36
  Top 0.406: RN4.2 20.77,62.48 13.A
N$37
  Top 0.406: RN4.3 17.47,61.68 14.A
N$38  (via drill 0.6)
  Top 0.406: IC1.29 58.58,46.22 58.85,45.95 v61.39,45.95 | RESET.1 45.79,57.48 46.53,56.74 63.42,56.74 64.69,55.47 SERIALPROG.1 | ICSP.5 65.33,36.68 v64.69,37.31
  Bottom 0.406: SERIALPROG.1 64.69,46.08 | 64.69,46.08 64.69,39.22 v64.69,37.31 | v61.39,45.95 64.56,45.95 64.69,46.08
N$39
  Top 0.406: DIAG.A 67.87,39.64 R1.2
N$40
  Top 0.406: RN4.4 12.68,60.88 15.A
N$41
  Top 0.406: IC5.15 35.43,51.46 34.08,52.81 31.29,52.81 29.71,54.39 RN5.8
N$42
  Top 0.406: RN5.7 29.37,53.59 30.84,52.11 IC5.1
N$43
  Top 0.406: RN5.6 29.02,52.79 30.35,51.46 IC5.2
N$44
  Top 0.406: IC5.3 29.86,50.81 28.68,51.99 RN5.5
N$45
  Top 0.406: IC5.4 29.36,50.16 28.95,50.58 RN6.8
N$46
  Top 0.406: IC5.5 29,49.51 28.75,49.76 27.87,49.76 RN6.7
N$47
  Top 0.406: IC5.6 28.63,48.86 28.5,49 27.87,49 RN6.6
N$48
  Top 0.406: IC5.7 27.88,48.21 RN6.5
N$49
  Top 0.406: RN5.1 16.A
N$50
  Top 0.406: RN5.2 17.A
N$51
  Top 0.406: RN5.3 18.A
N$52
  Top 0.406: RN5.4 19.A
N$53
  Top 0.406: RN6.1 20.A
N$54
  Top 0.406: RN6.2 21.A
N$55
  Top 0.406: RN6.3 22.A
N$56
  Top 0.406: RN6.4 23.A
N$57
  Top 0.406: IC6.2 30.48,38.25 29.91,38.82 RN7.6
N$58
  Top 0.406: RN7.5 29.57,38.02 29.98,37.6 IC6.3
N$59
  Top 0.406: IC1.7 51.77,41.54 X1.2 49.52,40.42 48.5,41.44 C9.2
N$60
  Top 0.406: IC1.8 52.37,40.74 51.48,39.85 51.48,36.42 X1.1 49.01,33.95 48.5,33.44 C10.2
N$61
  Top 0.406: RN8.8 29.57,36.61 29.91,36.95 IC6.4
N$62
  Top 0.406: RN8.7 29.91,35.81 30.41,36.3 IC6.5
N$63
  Top 0.406: RN8.6 30.25,35.01 30.9,35.65 IC6.6
N$64
  Top 0.406: IC6.7 31.27,35 30.47,34.21 RN8.5
N$65
  Top 0.406: IC7.15 35.18,25.04 33.83,26.39 27.91,26.39 RN9.8
N$66
  Top 0.406: RN7.1 15.6,40.42 24.A
N$67
  Top 0.406: RN7.2 19.88,39.62 25.A
N$68
  Top 0.406: RN7.3 21.75,38.82 20.94,38.01 | 20.94,38.01 20.88,37.95 | 26.A 20.94,38.01
N$69
  Top 0.406: RN7.4 22.22,38.02 18.46,34.26 27.A
N$70
  Top 0.406: RN8.1 22.2,36.61 19.48,33.88 19.48,31.98 28.A
N$71
  Top 0.406: RN8.2 22.67,35.81 20.49,33.63 20.49,29.95 20.37,29.82 29.A
N$72
  Top 0.406: RN8.3 23.02,35.01 21.26,33.25 21.26,27.91 30.A
N$73
  Top 0.406: RN8.4 23.49,34.21 22.15,32.87 22.15,25.63 22.02,25.5 31.A
N$74
  Top 0.406: IC7.1 27.9,25.69 RN9.7
N$75
  Top 0.406: RN9.6 29.75,24.85 29.94,25.04 IC7.2
N$76
  Top 0.406: RN9.5 30.09,24.05 30.44,24.39 IC7.3
N$77
  Top 0.406: RN10.8 28.57,21.51 30.8,23.74 IC7.4
N$78
  Top 0.406: RN10.7 29.37,21.42 31.04,23.09 IC7.5
N$79
  Top 0.406: RN10.6 30.17,21.2 31.41,22.44 IC7.6
N$80
  Top 0.406: RN10.5 30.97,21.11 31.67,21.82 31.69,21.79 IC7.7
N$81
  Top 0.406: RN9.1 24.11,26.45 22.53,24.87 22.53,22.83 32.A
N$82
  Top 0.406: RN9.2 24.58,25.65 23.42,24.49 23.42,19.91 19.61,15.09 33.A
N$83
  Top 0.406: RN9.3 25.3,24.85 24.3,23.85 24.3,16.61 34.A
N$84
  Top 0.406: RN9.4 25.9,24.05 25.19,23.34 25.19,11.79 24.69,11.28 | 24.69,11.28 23.42,11.28 | 35.A 24.4,11.56 24.69,11.28
N$85
  Top 0.406: RN10.1 28.57,13.63 36.A
N$86
  Top 0.406: RN10.2 29.37,13.84 30.78,12.42 37.A
N$87
  Top 0.406: RN10.3 30.17,14.31 33.32,11.15 38.A
N$88
  Top 0.406: RN10.4 30.97,14.78 35.86,9.88 39.A
RCK  (via drill 0.6)
  Top 0.254: IC5.12 39.54,49.51 40.18,48.87 v41.25,48.87 | IC4.12 39.79,62.72 40.18,62.33 v41.25,62.33 | IC6.12 39.54,36.3 39.93,35.92 v41.25,35.92 | IC7.12 39.54,23.09 39.93,22.71 v41.25,22.71 | IC3.12 39.79,75.93 39.93,75.79 41.2,75.79 v41.25,75.84 | IC1.9 56.18,31.59 55.67,31.09 v41.25,31.09
  Bottom 0.254: v41.25,75.84 41.25,64.62 | 41.25,64.62 41.25,63.35 | 41.25,63.35 v41.25,62.33 | v41.25,62.33 41.25,50.65 | 41.25,50.65 v41.25,48.87 | v41.25,48.87 41.25,36.68 | 41.25,36.68 v41.25,35.92 | v41.25,35.92 41.25,31.6 | 41.25,31.6 v41.25,31.09 | v41.25,31.09 41.25,25.25 | 41.25,25.25 v41.25,22.71 41.25,25.25 | 41.25,63.35 41.25,64.62 | v41.25,48.87 41.25,50.65 | v41.25,62.33 41.25,63.35 | v41.25,35.92 41.25,36.68 | v41.25,31.09 41.25,31.6
SCK  (via drill 0.6)
  Top 0.254: IC5.11 39.43,48.86 40.43,47.85 v42.21,47.85 | IC4.11 39.68,62.07 40.43,61.32 41.96,61.32 v42.21,61.32 | IC6.11 39.43,35.65 40.18,34.9 v42.21,34.9 | IC7.11 39.43,22.44 40.18,21.69 v42.21,21.69 | IC3.11 39.68,75.28 40.18,74.78 v42.21,74.78 | IC1.2 43.96,45.54 43.23,44.81 v42.21,44.81
  Bottom 0.254: v42.21,74.78 42.21,62.08 | 42.21,62.08 v42.21,61.32 | v42.21,61.32 42.21,50.65 | 42.21,50.65 v42.21,47.85 | v42.21,47.85 42.21,45.57 | 42.21,45.57 v42.21,44.81 | v42.21,44.81 42.21,43.03 | 42.21,43.03 42.21,39.22 | 42.21,39.22 v42.21,34.9 | v42.21,34.9 v42.21,21.69 42.21,22.45 | v42.21,47.85 42.21,50.65 | v42.21,61.32 42.21,62.08 | v42.21,34.9 42.21,39.22 | 42.21,45.57 v42.21,44.81 | v42.21,44.81 42.21,43.03 | v42.21,44.81 42.21,43.03
SENSOR  (via drill 0.6)
  Top 0.254: IC1.32 55.9,48.11 v46.28,48.11 | v43.23,20.47 46.07,17.63 56.44,17.63 57.71,17.63 58.58,17.63 S1.3
  Bottom 0.254: v46.28,48.11 43.23,45.06 43.23,43.03 43.23,21.51 v43.23,20.47
SER1
  Top 0.254: IC3.14 35.26,77.23 34.34,76.3 34.34,73.51 43.23,64.62 43.23,53.44 44.24,52.43 63.55,52.43 65.07,50.9 65.07,46.33 64.31,45.57 63.3,45.57 IC1.23
SER2
  Top 0.254: IC4.14 35.26,64.02 34.34,63.09 34.34,61.32 43.74,52.04 43.99,51.79 61.9,51.79 63.04,50.65 63.04,46.56 IC1.24
SER3
  Top 0.254: IC5.14 39.58,50.81 39.93,51.16 44.12,51.16 61.39,51.16 61.77,50.77 IC1.25
SER4
  Top 0.254: IC1.26 60.98,50.43 60.75,50.52 44.24,50.52 43.48,49.89 43.48,47.09 42.97,46.58 40.69,46.58 40.18,46.08 40.18,38.46 39.42,37.69 39.33,37.6 IC6.14
SER5
  Top 0.254: IC1.27 60.18,49.7 59.99,49.89 44.75,49.89 44.24,49.38 44.24,46.84 43.99,46.58 43.48,46.08 43.23,45.82 41.2,45.82 40.94,45.57 40.94,38.2 42.97,36.17 43.48,35.66 43.48,33.38 42.97,32.87 40.18,32.87 38.91,31.6 38.91,28.55 40.18,27.28 40.18,25.25 39.33,24.39 IC7.14
SWITCH1
  Top 0.254: IC1.12 58.58,31.96 57.96,31.34 56.44,29.82 50.59,29.82 50.19,29.41 A.1
SWITCH2
  Top 0.254: IC1.13 59.38,31.74 57.2,29.57 57.2,27.64 B.1
SWITCH3
  Top 0.254: IC1.14 60.18,31.72 C.1
(copper drawn outside any net)
  shapes: Top area x5

### Text on the board
tNames: 1
tDocu: hotchk155 | POV | POV | GLOBE | GLOBE | rev 3